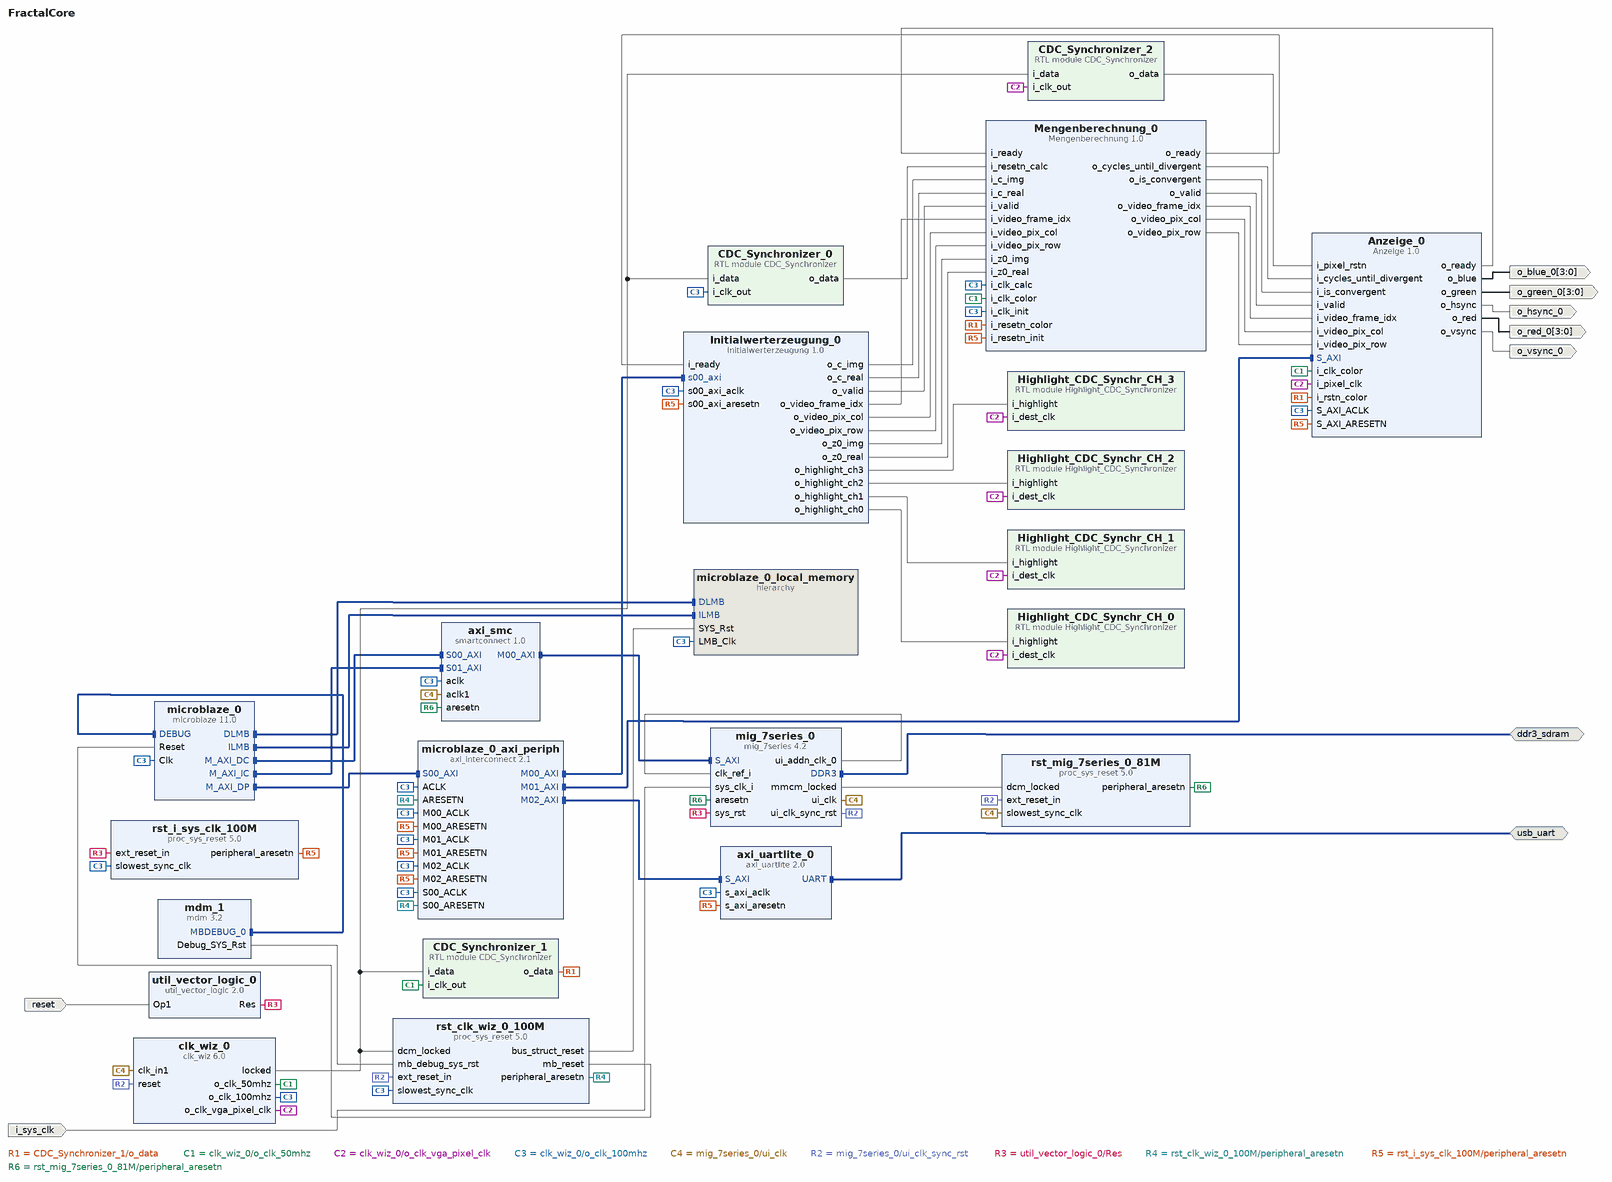
[diagram p0: block diagram of the top level]
# Vivado block design FractalCore, xc7a100tcsg324-1, Vivado 2023.2
create_bd_design FractalCore

create_bd_intf_port -mode Master -vlnv xilinx.com:interface:ddrx_rtl:1.0 ddr3_sdram
create_bd_intf_port -mode Master -vlnv xilinx.com:interface:uart_rtl:1.0 usb_uart
create_bd_port -dir I -type clk i_sys_clk
create_bd_port -dir I -type rst reset
set_property -dict {CONFIG.POLARITY ACTIVE_HIGH} [get_bd_ports reset]
create_bd_port -dir O o_vsync_0
create_bd_port -dir O o_hsync_0
create_bd_port -dir O -from 3 -to 0 o_red_0
create_bd_port -dir O -from 3 -to 0 o_green_0
create_bd_port -dir O -from 3 -to 0 o_blue_0

create_bd_cell -type ip -vlnv xilinx.com:ip:mig_7series:4.2 mig_7series_0
set_property -dict {CONFIG.BOARD_MIG_PARAM ddr3_sdram CONFIG.RESET_BOARD_INTERFACE reset} [get_bd_cells mig_7series_0]
create_bd_cell -type ip -vlnv xilinx.com:ip:clk_wiz:6.0 clk_wiz_0
set_property -dict [list \
  CONFIG.CLKOUT1_JITTER 166.149 \
  CONFIG.CLKOUT1_PHASE_ERROR 134.239 \
  CONFIG.CLKOUT1_REQUESTED_OUT_FREQ 100.000 \
  CONFIG.CLKOUT2_JITTER 191.375 \
  CONFIG.CLKOUT2_PHASE_ERROR 134.239 \
  CONFIG.CLKOUT2_REQUESTED_OUT_FREQ 50.000 \
  CONFIG.CLKOUT2_USED true \
  CONFIG.CLKOUT3_JITTER 219.979 \
  CONFIG.CLKOUT3_PHASE_ERROR 134.239 \
  CONFIG.CLKOUT3_REQUESTED_OUT_FREQ 25.175 \
  CONFIG.CLKOUT3_USED true \
  CONFIG.CLKOUT4_JITTER 189.214 \
  CONFIG.CLKOUT4_PHASE_ERROR 210.820 \
  CONFIG.CLKOUT4_REQUESTED_OUT_FREQ 100.000 \
  CONFIG.CLKOUT4_USED false \
  CONFIG.CLKOUT5_JITTER 189.214 \
  CONFIG.CLKOUT5_PHASE_ERROR 210.820 \
  CONFIG.CLKOUT5_USED false \
  CONFIG.CLK_OUT1_PORT o_clk_100mhz \
  CONFIG.CLK_OUT2_PORT o_clk_50mhz \
  CONFIG.CLK_OUT3_PORT o_clk_vga_pixel_clk \
  CONFIG.CLK_OUT4_PORT clk_out4 \
  CONFIG.CLK_OUT5_PORT clk_out5 \
  CONFIG.MMCM_CLKFBOUT_MULT_F 8.000 \
  CONFIG.MMCM_CLKIN2_PERIOD 10.000 \
  CONFIG.MMCM_CLKOUT0_DIVIDE_F 6.500 \
  CONFIG.MMCM_CLKOUT1_DIVIDE 13 \
  CONFIG.MMCM_CLKOUT2_DIVIDE 26 \
  CONFIG.MMCM_CLKOUT3_DIVIDE 1 \
  CONFIG.MMCM_CLKOUT4_DIVIDE 1 \
  CONFIG.MMCM_DIVCLK_DIVIDE 1 \
  CONFIG.NUM_OUT_CLKS 3 \
] [get_bd_cells clk_wiz_0]
create_bd_cell -type ip -vlnv xilinx.com:ip:microblaze:11.0 microblaze_0
set_property -dict [list \
  CONFIG.C_CACHE_BYTE_SIZE 8192 \
  CONFIG.C_DCACHE_BYTE_SIZE 8192 \
  CONFIG.C_DEBUG_ENABLED 1 \
  CONFIG.C_D_AXI 1 \
  CONFIG.C_D_LMB 1 \
  CONFIG.C_I_LMB 1 \
  CONFIG.C_USE_DCACHE 1 \
  CONFIG.C_USE_ICACHE 1 \
] [get_bd_cells microblaze_0]
create_bd_cell -type hier microblaze_0_local_memory
create_bd_cell -type ip -vlnv xilinx.com:ip:mdm:3.2 mdm_1
create_bd_cell -type ip -vlnv xilinx.com:ip:proc_sys_reset:5.0 rst_clk_wiz_0_100M
create_bd_cell -type ip -vlnv xilinx.com:ip:smartconnect:1.0 axi_smc
set_property -dict {CONFIG.NUM_CLKS 2 CONFIG.NUM_SI 2} [get_bd_cells axi_smc]
create_bd_cell -type ip -vlnv xilinx.com:ip:proc_sys_reset:5.0 rst_mig_7series_0_81M
create_bd_cell -type ip -vlnv user.org:user:Initialwerterzeugung:1.0 Initialwerterzeugung_0
create_bd_cell -type ip -vlnv user.org:user:Mengenberechnung:1.0 Mengenberechnung_0
create_bd_cell -type module -reference Highlight_CDC_Synchronizer Highlight_CDC_Synchr_CH_0
create_bd_cell -type module -reference Highlight_CDC_Synchronizer Highlight_CDC_Synchr_CH_1
create_bd_cell -type module -reference Highlight_CDC_Synchronizer Highlight_CDC_Synchr_CH_2
create_bd_cell -type module -reference Highlight_CDC_Synchronizer Highlight_CDC_Synchr_CH_3
create_bd_cell -type ip -vlnv xilinx.com:ip:axi_interconnect:2.1 microblaze_0_axi_periph
set_property -dict {CONFIG.NUM_MI 3} [get_bd_cells microblaze_0_axi_periph]
create_bd_cell -type ip -vlnv xilinx.com:ip:proc_sys_reset:5.0 rst_i_sys_clk_100M
set_property -dict {CONFIG.RESET_BOARD_INTERFACE reset CONFIG.USE_BOARD_FLOW true} [get_bd_cells rst_i_sys_clk_100M]
create_bd_cell -type module -reference CDC_Synchronizer CDC_Synchronizer_0
create_bd_cell -type module -reference CDC_Synchronizer CDC_Synchronizer_1
create_bd_cell -type module -reference CDC_Synchronizer CDC_Synchronizer_2
create_bd_cell -type ip -vlnv user.org:user:Anzeige:1.0 Anzeige_0
create_bd_cell -type ip -vlnv xilinx.com:ip:axi_uartlite:2.0 axi_uartlite_0
set_property -dict {CONFIG.UARTLITE_BOARD_INTERFACE usb_uart CONFIG.USE_BOARD_FLOW true} [get_bd_cells axi_uartlite_0]
create_bd_cell -type ip -vlnv xilinx.com:ip:util_vector_logic:2.0 util_vector_logic_0
set_property -dict {CONFIG.C_OPERATION not CONFIG.C_SIZE 1} [get_bd_cells util_vector_logic_0]

# ---- hierarchy /microblaze_0_local_memory ----
current_bd_instance /microblaze_0_local_memory
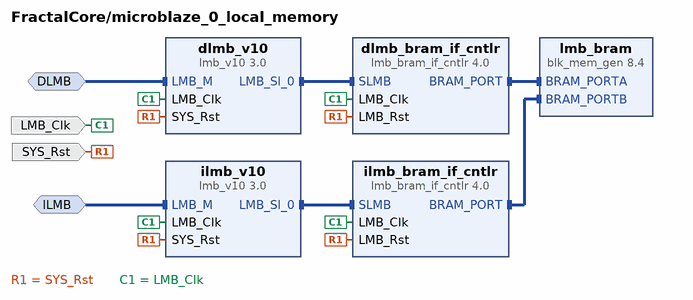
[diagram p1: block diagram inside /microblaze_0_local_memory]
create_bd_intf_pin -mode MirroredMaster -vlnv xilinx.com:interface:lmb_rtl:1.0 DLMB
create_bd_intf_pin -mode MirroredMaster -vlnv xilinx.com:interface:lmb_rtl:1.0 ILMB
create_bd_pin -dir I -type clk LMB_Clk
create_bd_pin -dir I -type rst SYS_Rst

create_bd_cell -type ip -vlnv xilinx.com:ip:lmb_v10:3.0 dlmb_v10
create_bd_cell -type ip -vlnv xilinx.com:ip:lmb_v10:3.0 ilmb_v10
create_bd_cell -type ip -vlnv xilinx.com:ip:lmb_bram_if_cntlr:4.0 dlmb_bram_if_cntlr
set_property -dict {CONFIG.C_ECC 0} [get_bd_cells dlmb_bram_if_cntlr]
create_bd_cell -type ip -vlnv xilinx.com:ip:lmb_bram_if_cntlr:4.0 ilmb_bram_if_cntlr
set_property -dict {CONFIG.C_ECC 0} [get_bd_cells ilmb_bram_if_cntlr]
create_bd_cell -type ip -vlnv xilinx.com:ip:blk_mem_gen:8.4 lmb_bram
set_property -dict {CONFIG.Memory_Type True_Dual_Port_RAM CONFIG.use_bram_block BRAM_Controller} [get_bd_cells lmb_bram]

# ---- connections ----

current_bd_instance /microblaze_0_local_memory
connect_bd_intf_net -intf_net microblaze_0_dlmb [get_bd_intf_pins dlmb_v10/LMB_M] [get_bd_intf_pins DLMB]
connect_bd_intf_net -intf_net microblaze_0_dlmb_bus [get_bd_intf_pins dlmb_v10/LMB_Sl_0] [get_bd_intf_pins dlmb_bram_if_cntlr/SLMB]
connect_bd_intf_net -intf_net microblaze_0_dlmb_cntlr [get_bd_intf_pins dlmb_bram_if_cntlr/BRAM_PORT] [get_bd_intf_pins lmb_bram/BRAM_PORTA]
connect_bd_intf_net -intf_net microblaze_0_ilmb [get_bd_intf_pins ilmb_v10/LMB_M] [get_bd_intf_pins ILMB]
connect_bd_intf_net -intf_net microblaze_0_ilmb_bus [get_bd_intf_pins ilmb_v10/LMB_Sl_0] [get_bd_intf_pins ilmb_bram_if_cntlr/SLMB]
connect_bd_intf_net -intf_net microblaze_0_ilmb_cntlr [get_bd_intf_pins ilmb_bram_if_cntlr/BRAM_PORT] [get_bd_intf_pins lmb_bram/BRAM_PORTB]
connect_bd_net [get_bd_pins SYS_Rst] \
  [get_bd_pins dlmb_v10/SYS_Rst] [get_bd_pins dlmb_bram_if_cntlr/LMB_Rst] [get_bd_pins ilmb_v10/SYS_Rst] \
  [get_bd_pins ilmb_bram_if_cntlr/LMB_Rst]
connect_bd_net -net microblaze_0_Clk [get_bd_pins LMB_Clk] \
  [get_bd_pins dlmb_v10/LMB_Clk] [get_bd_pins dlmb_bram_if_cntlr/LMB_Clk] [get_bd_pins ilmb_v10/LMB_Clk] \
  [get_bd_pins ilmb_bram_if_cntlr/LMB_Clk]
set_property HDL_ATTRIBUTE.BMM_INFO_ADDRESS_SPACE {byte  0x00000000 32 > FractalCore microblaze_0_local_memory/lmb_bram} [get_bd_cells dlmb_bram_if_cntlr]
set_property HDL_ATTRIBUTE.KEEP_HIERARCHY yes [get_bd_cells dlmb_bram_if_cntlr]

current_bd_instance /
connect_bd_intf_net [get_bd_intf_pins axi_smc/M00_AXI] [get_bd_intf_pins mig_7series_0/S_AXI]
connect_bd_intf_net [get_bd_intf_ports usb_uart] [get_bd_intf_pins axi_uartlite_0/UART]
connect_bd_intf_net [get_bd_intf_pins microblaze_0/M_AXI_DC] [get_bd_intf_pins axi_smc/S00_AXI]
connect_bd_intf_net [get_bd_intf_pins microblaze_0/M_AXI_DP] [get_bd_intf_pins microblaze_0_axi_periph/S00_AXI]
connect_bd_intf_net [get_bd_intf_pins microblaze_0/M_AXI_IC] [get_bd_intf_pins axi_smc/S01_AXI]
connect_bd_intf_net [get_bd_intf_pins microblaze_0_axi_periph/M00_AXI] [get_bd_intf_pins Initialwerterzeugung_0/s00_axi]
connect_bd_intf_net [get_bd_intf_pins microblaze_0_axi_periph/M01_AXI] [get_bd_intf_pins Anzeige_0/S_AXI]
connect_bd_intf_net [get_bd_intf_pins microblaze_0_axi_periph/M02_AXI] [get_bd_intf_pins axi_uartlite_0/S_AXI]
connect_bd_intf_net [get_bd_intf_pins mdm_1/MBDEBUG_0] [get_bd_intf_pins microblaze_0/DEBUG]
connect_bd_intf_net [get_bd_intf_pins microblaze_0/DLMB] [get_bd_intf_pins microblaze_0_local_memory/DLMB]
connect_bd_intf_net [get_bd_intf_pins microblaze_0/ILMB] [get_bd_intf_pins microblaze_0_local_memory/ILMB]
connect_bd_intf_net [get_bd_intf_ports ddr3_sdram] [get_bd_intf_pins mig_7series_0/DDR3]
connect_bd_net [get_bd_pins Anzeige_0/o_blue] [get_bd_ports o_blue_0]
connect_bd_net [get_bd_pins Anzeige_0/o_green] [get_bd_ports o_green_0]
connect_bd_net [get_bd_pins Anzeige_0/o_hsync] [get_bd_ports o_hsync_0]
connect_bd_net [get_bd_pins Anzeige_0/o_ready] [get_bd_pins Mengenberechnung_0/i_ready]
connect_bd_net [get_bd_pins Anzeige_0/o_red] [get_bd_ports o_red_0]
connect_bd_net [get_bd_pins Anzeige_0/o_vsync] [get_bd_ports o_vsync_0]
connect_bd_net [get_bd_pins CDC_Synchronizer_0/o_data] [get_bd_pins Mengenberechnung_0/i_resetn_calc]
connect_bd_net [get_bd_pins CDC_Synchronizer_1/o_data] [get_bd_pins Mengenberechnung_0/i_resetn_color] [get_bd_pins Anzeige_0/i_rstn_color]
connect_bd_net [get_bd_pins CDC_Synchronizer_2/o_data] [get_bd_pins Anzeige_0/i_pixel_rstn]
connect_bd_net [get_bd_pins Initialwerterzeugung_0/o_c_img] [get_bd_pins Mengenberechnung_0/i_c_img]
connect_bd_net [get_bd_pins Initialwerterzeugung_0/o_c_real] [get_bd_pins Mengenberechnung_0/i_c_real]
connect_bd_net [get_bd_pins Initialwerterzeugung_0/o_highlight_ch0] [get_bd_pins Highlight_CDC_Synchr_CH_0/i_highlight]
connect_bd_net [get_bd_pins Initialwerterzeugung_0/o_highlight_ch1] [get_bd_pins Highlight_CDC_Synchr_CH_1/i_highlight]
connect_bd_net [get_bd_pins Initialwerterzeugung_0/o_highlight_ch2] [get_bd_pins Highlight_CDC_Synchr_CH_2/i_highlight]
connect_bd_net [get_bd_pins Initialwerterzeugung_0/o_highlight_ch3] [get_bd_pins Highlight_CDC_Synchr_CH_3/i_highlight]
connect_bd_net [get_bd_pins Initialwerterzeugung_0/o_valid] [get_bd_pins Mengenberechnung_0/i_valid]
connect_bd_net [get_bd_pins Initialwerterzeugung_0/o_video_frame_idx] [get_bd_pins Mengenberechnung_0/i_video_frame_idx]
connect_bd_net [get_bd_pins Initialwerterzeugung_0/o_video_pix_col] [get_bd_pins Mengenberechnung_0/i_video_pix_col]
connect_bd_net [get_bd_pins Initialwerterzeugung_0/o_video_pix_row] [get_bd_pins Mengenberechnung_0/i_video_pix_row]
connect_bd_net [get_bd_pins Initialwerterzeugung_0/o_z0_img] [get_bd_pins Mengenberechnung_0/i_z0_img]
connect_bd_net [get_bd_pins Initialwerterzeugung_0/o_z0_real] [get_bd_pins Mengenberechnung_0/i_z0_real]
connect_bd_net [get_bd_pins Mengenberechnung_0/o_cycles_until_divergent] [get_bd_pins Anzeige_0/i_cycles_until_divergent]
connect_bd_net [get_bd_pins Mengenberechnung_0/o_is_convergent] [get_bd_pins Anzeige_0/i_is_convergent]
connect_bd_net [get_bd_pins Mengenberechnung_0/o_ready] [get_bd_pins Initialwerterzeugung_0/i_ready]
connect_bd_net [get_bd_pins Mengenberechnung_0/o_valid] [get_bd_pins Anzeige_0/i_valid]
connect_bd_net [get_bd_pins Mengenberechnung_0/o_video_frame_idx] [get_bd_pins Anzeige_0/i_video_frame_idx]
connect_bd_net [get_bd_pins Mengenberechnung_0/o_video_pix_col] [get_bd_pins Anzeige_0/i_video_pix_col]
connect_bd_net [get_bd_pins Mengenberechnung_0/o_video_pix_row] [get_bd_pins Anzeige_0/i_video_pix_row]
connect_bd_net [get_bd_pins clk_wiz_0/locked] \
  [get_bd_pins rst_clk_wiz_0_100M/dcm_locked] [get_bd_pins CDC_Synchronizer_0/i_data] [get_bd_pins CDC_Synchronizer_1/i_data] \
  [get_bd_pins CDC_Synchronizer_2/i_data]
connect_bd_net [get_bd_pins clk_wiz_0/o_clk_50mhz] \
  [get_bd_pins CDC_Synchronizer_1/i_clk_out] [get_bd_pins Mengenberechnung_0/i_clk_color] [get_bd_pins Anzeige_0/i_clk_color]
connect_bd_net -net clk_wiz_0_o_clk_vga [get_bd_pins clk_wiz_0/o_clk_vga_pixel_clk] \
  [get_bd_pins CDC_Synchronizer_2/i_clk_out] [get_bd_pins Highlight_CDC_Synchr_CH_0/i_dest_clk] \
  [get_bd_pins Highlight_CDC_Synchr_CH_3/i_dest_clk] [get_bd_pins Highlight_CDC_Synchr_CH_1/i_dest_clk] \
  [get_bd_pins Highlight_CDC_Synchr_CH_2/i_dest_clk] [get_bd_pins Anzeige_0/i_pixel_clk]
connect_bd_net [get_bd_ports i_sys_clk] [get_bd_pins mig_7series_0/sys_clk_i]
connect_bd_net [get_bd_pins mdm_1/Debug_SYS_Rst] [get_bd_pins rst_clk_wiz_0_100M/mb_debug_sys_rst]
connect_bd_net -net microblaze_0_Clk [get_bd_pins clk_wiz_0/o_clk_100mhz] \
  [get_bd_pins microblaze_0/Clk] [get_bd_pins microblaze_0_local_memory/LMB_Clk] \
  [get_bd_pins rst_clk_wiz_0_100M/slowest_sync_clk] [get_bd_pins axi_smc/aclk] [get_bd_pins microblaze_0_axi_periph/ACLK] \
  [get_bd_pins microblaze_0_axi_periph/S00_ACLK] [get_bd_pins microblaze_0_axi_periph/M00_ACLK] \
  [get_bd_pins rst_i_sys_clk_100M/slowest_sync_clk] [get_bd_pins microblaze_0_axi_periph/M01_ACLK] \
  [get_bd_pins axi_uartlite_0/s_axi_aclk] [get_bd_pins microblaze_0_axi_periph/M02_ACLK] \
  [get_bd_pins Mengenberechnung_0/i_clk_init] [get_bd_pins CDC_Synchronizer_0/i_clk_out] \
  [get_bd_pins Mengenberechnung_0/i_clk_calc] [get_bd_pins Initialwerterzeugung_0/s00_axi_aclk] \
  [get_bd_pins Anzeige_0/S_AXI_ACLK]
connect_bd_net [get_bd_pins mig_7series_0/mmcm_locked] [get_bd_pins rst_mig_7series_0_81M/dcm_locked]
connect_bd_net [get_bd_pins mig_7series_0/ui_addn_clk_0] [get_bd_pins mig_7series_0/clk_ref_i]
connect_bd_net [get_bd_pins mig_7series_0/ui_clk] \
  [get_bd_pins clk_wiz_0/clk_in1] [get_bd_pins axi_smc/aclk1] [get_bd_pins rst_mig_7series_0_81M/slowest_sync_clk]
connect_bd_net [get_bd_pins mig_7series_0/ui_clk_sync_rst] \
  [get_bd_pins clk_wiz_0/reset] [get_bd_pins rst_clk_wiz_0_100M/ext_reset_in] \
  [get_bd_pins rst_mig_7series_0_81M/ext_reset_in]
connect_bd_net -net reset_1 [get_bd_pins util_vector_logic_0/Res] [get_bd_pins mig_7series_0/sys_rst] [get_bd_pins rst_i_sys_clk_100M/ext_reset_in]
connect_bd_net [get_bd_ports reset] [get_bd_pins util_vector_logic_0/Op1]
connect_bd_net [get_bd_pins rst_clk_wiz_0_100M/bus_struct_reset] [get_bd_pins microblaze_0_local_memory/SYS_Rst]
connect_bd_net [get_bd_pins rst_clk_wiz_0_100M/mb_reset] [get_bd_pins microblaze_0/Reset]
connect_bd_net [get_bd_pins rst_clk_wiz_0_100M/peripheral_aresetn] \
  [get_bd_pins microblaze_0_axi_periph/S00_ARESETN] [get_bd_pins microblaze_0_axi_periph/ARESETN]
connect_bd_net [get_bd_pins rst_i_sys_clk_100M/peripheral_aresetn] \
  [get_bd_pins microblaze_0_axi_periph/M00_ARESETN] [get_bd_pins microblaze_0_axi_periph/M01_ARESETN] \
  [get_bd_pins axi_uartlite_0/s_axi_aresetn] [get_bd_pins microblaze_0_axi_periph/M02_ARESETN] \
  [get_bd_pins Mengenberechnung_0/i_resetn_init] [get_bd_pins Initialwerterzeugung_0/s00_axi_aresetn] \
  [get_bd_pins Anzeige_0/S_AXI_ARESETN]
connect_bd_net [get_bd_pins rst_mig_7series_0_81M/peripheral_aresetn] [get_bd_pins mig_7series_0/aresetn] [get_bd_pins axi_smc/aresetn]
set_property HDL_ATTRIBUTE.BMM_INFO_PROCESSOR {microblaze-le > FractalCore microblaze_0_local_memory/dlmb_bram_if_cntlr} [get_bd_cells microblaze_0]
set_property HDL_ATTRIBUTE.KEEP_HIERARCHY yes [get_bd_cells microblaze_0]

# ---- address map ----
assign_bd_address -offset 0x00000000 -range 16K -target_address_space [get_bd_addr_spaces microblaze_0/Data] [get_bd_addr_segs microblaze_0_local_memory/dlmb_bram_if_cntlr/SLMB/Mem]
assign_bd_address -offset 0x00004000 -range 4K -target_address_space [get_bd_addr_spaces microblaze_0/Data] [get_bd_addr_segs Anzeige_0/S_AXI/reg0]
assign_bd_address -offset 0x00010000 -range 4K -target_address_space [get_bd_addr_spaces microblaze_0/Data] [get_bd_addr_segs Initialwerterzeugung_0/s00_axi/reg0]
assign_bd_address -offset 0x40600000 -range 64K -target_address_space [get_bd_addr_spaces microblaze_0/Data] [get_bd_addr_segs axi_uartlite_0/S_AXI/Reg]
assign_bd_address -offset 0x80000000 -range 256M -target_address_space [get_bd_addr_spaces microblaze_0/Data] [get_bd_addr_segs mig_7series_0/memmap/memaddr]
assign_bd_address -offset 0x00000000 -range 16K -target_address_space [get_bd_addr_spaces microblaze_0/Instruction] [get_bd_addr_segs microblaze_0_local_memory/ilmb_bram_if_cntlr/SLMB/Mem]
assign_bd_address -offset 0x80000000 -range 256M -target_address_space [get_bd_addr_spaces microblaze_0/Instruction] [get_bd_addr_segs mig_7series_0/memmap/memaddr]

validate_bd_design
save_bd_design
